# Altium schematic sheet 07.USB_DP Configure Map.SchDoc
size 840 x 594 mm; Revision: V2.1; Schematic Page Number: 11; Page Number: 8; Check: <Checker>; Schematic Name: RK_NVR_DEMO1_RK3588_LP4/4x_V21; Page Count: 43; Page name: 07.USB/DP Configure Map; Designer: Zhangdz; Schematic Page Count: 99; Revcode: V2.1; DsnPath: E:\Work\SBER\RK3588_SOM\temp\RK_NVR_DEMO1_RK3588_LP4XD200P232SD8_V21_20211228.DSN; SchematicName: RK_NVR_DEMO1_RK3588_LP4/4x_V21; PageName: 07.USB/DP Configure Map; PageSize: A1; TopSchematic: True
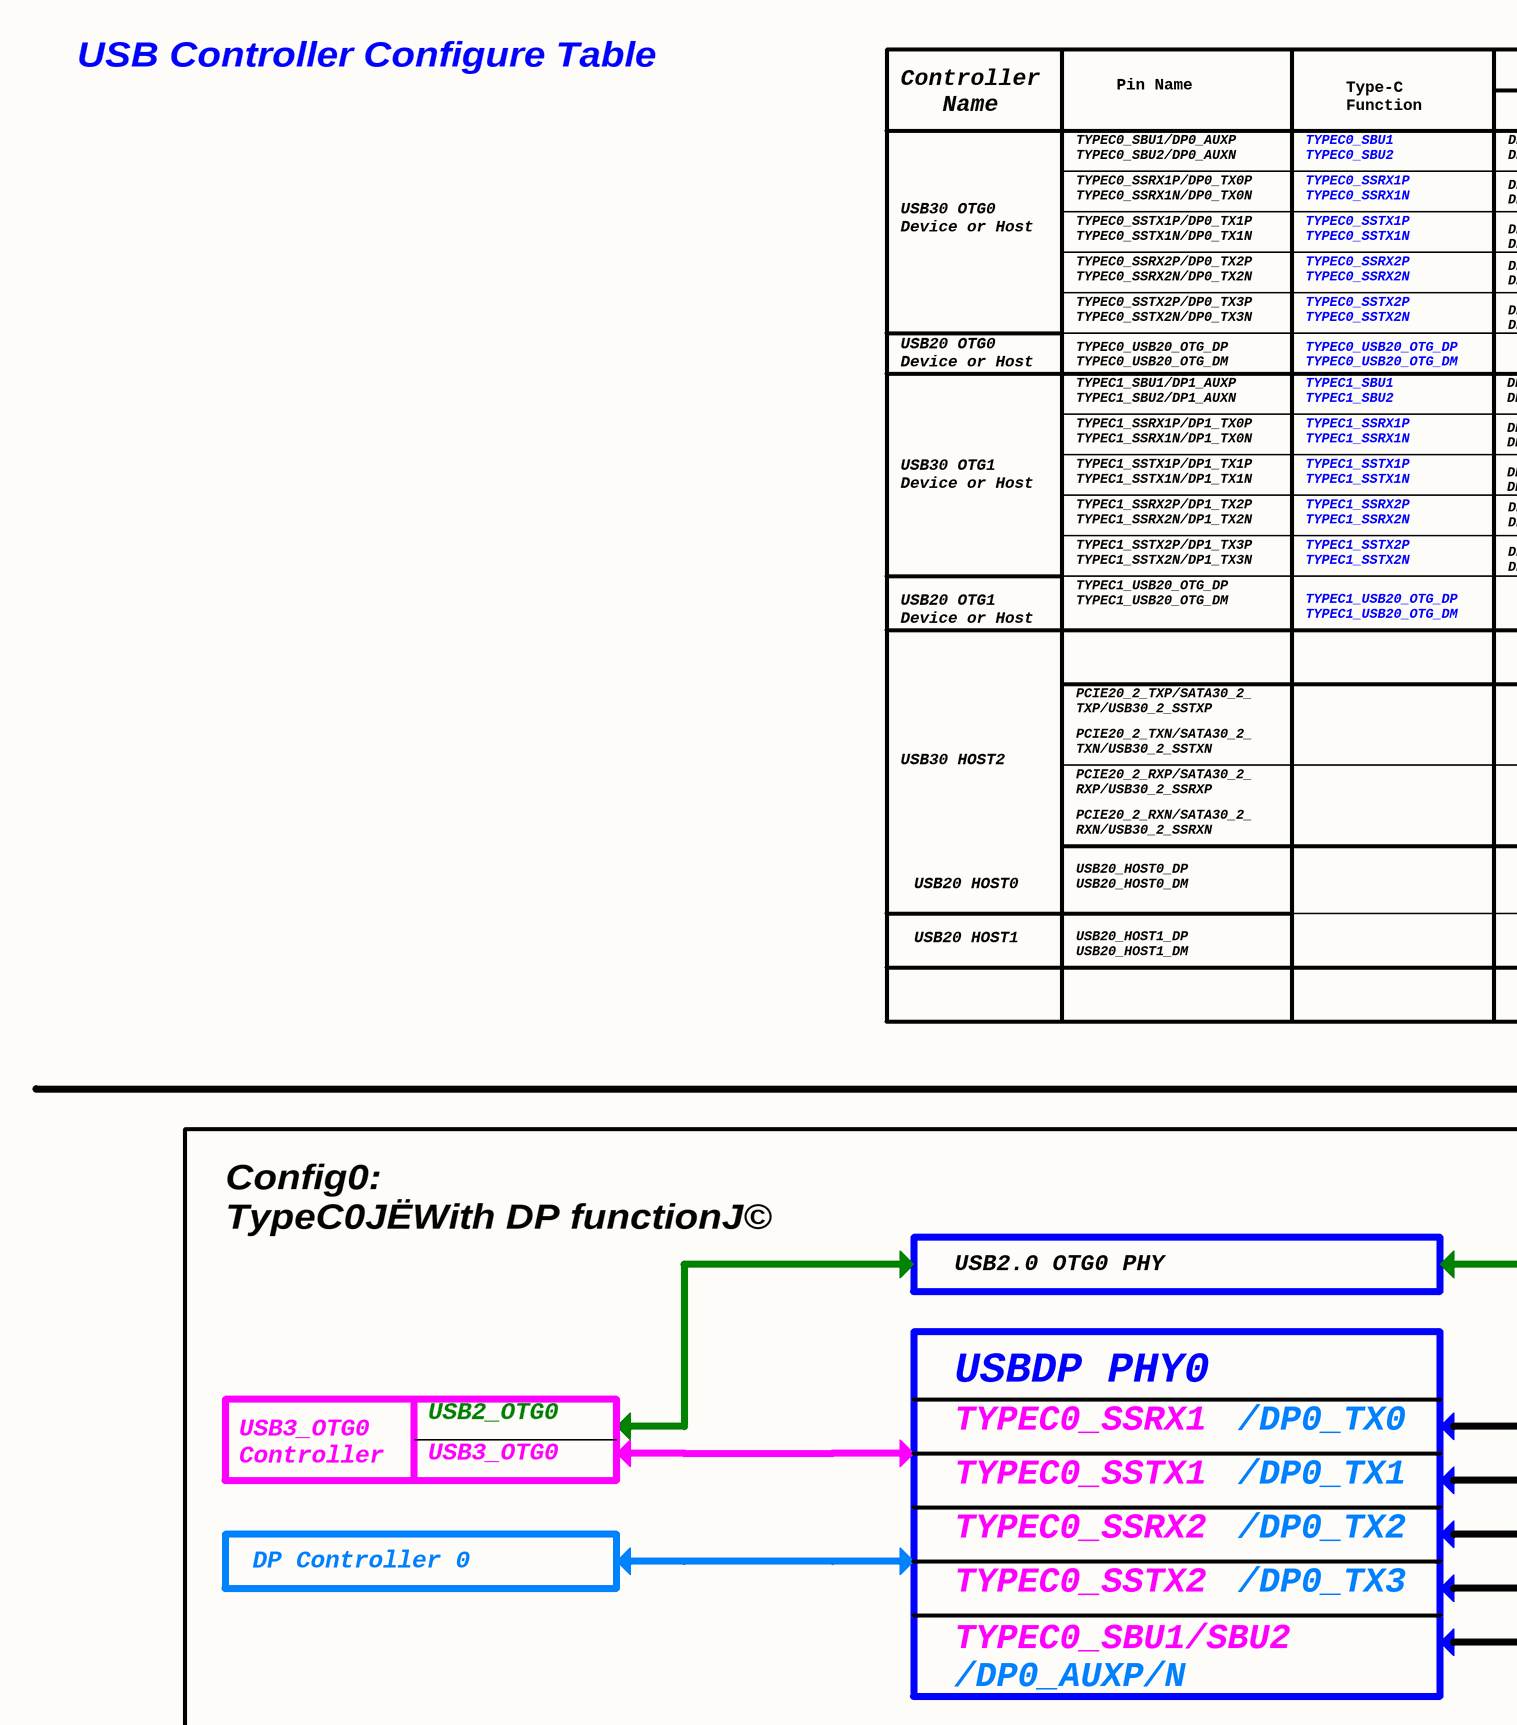
[diagram p0: 07.USB_DP Configure Map.SchDoc, top left]
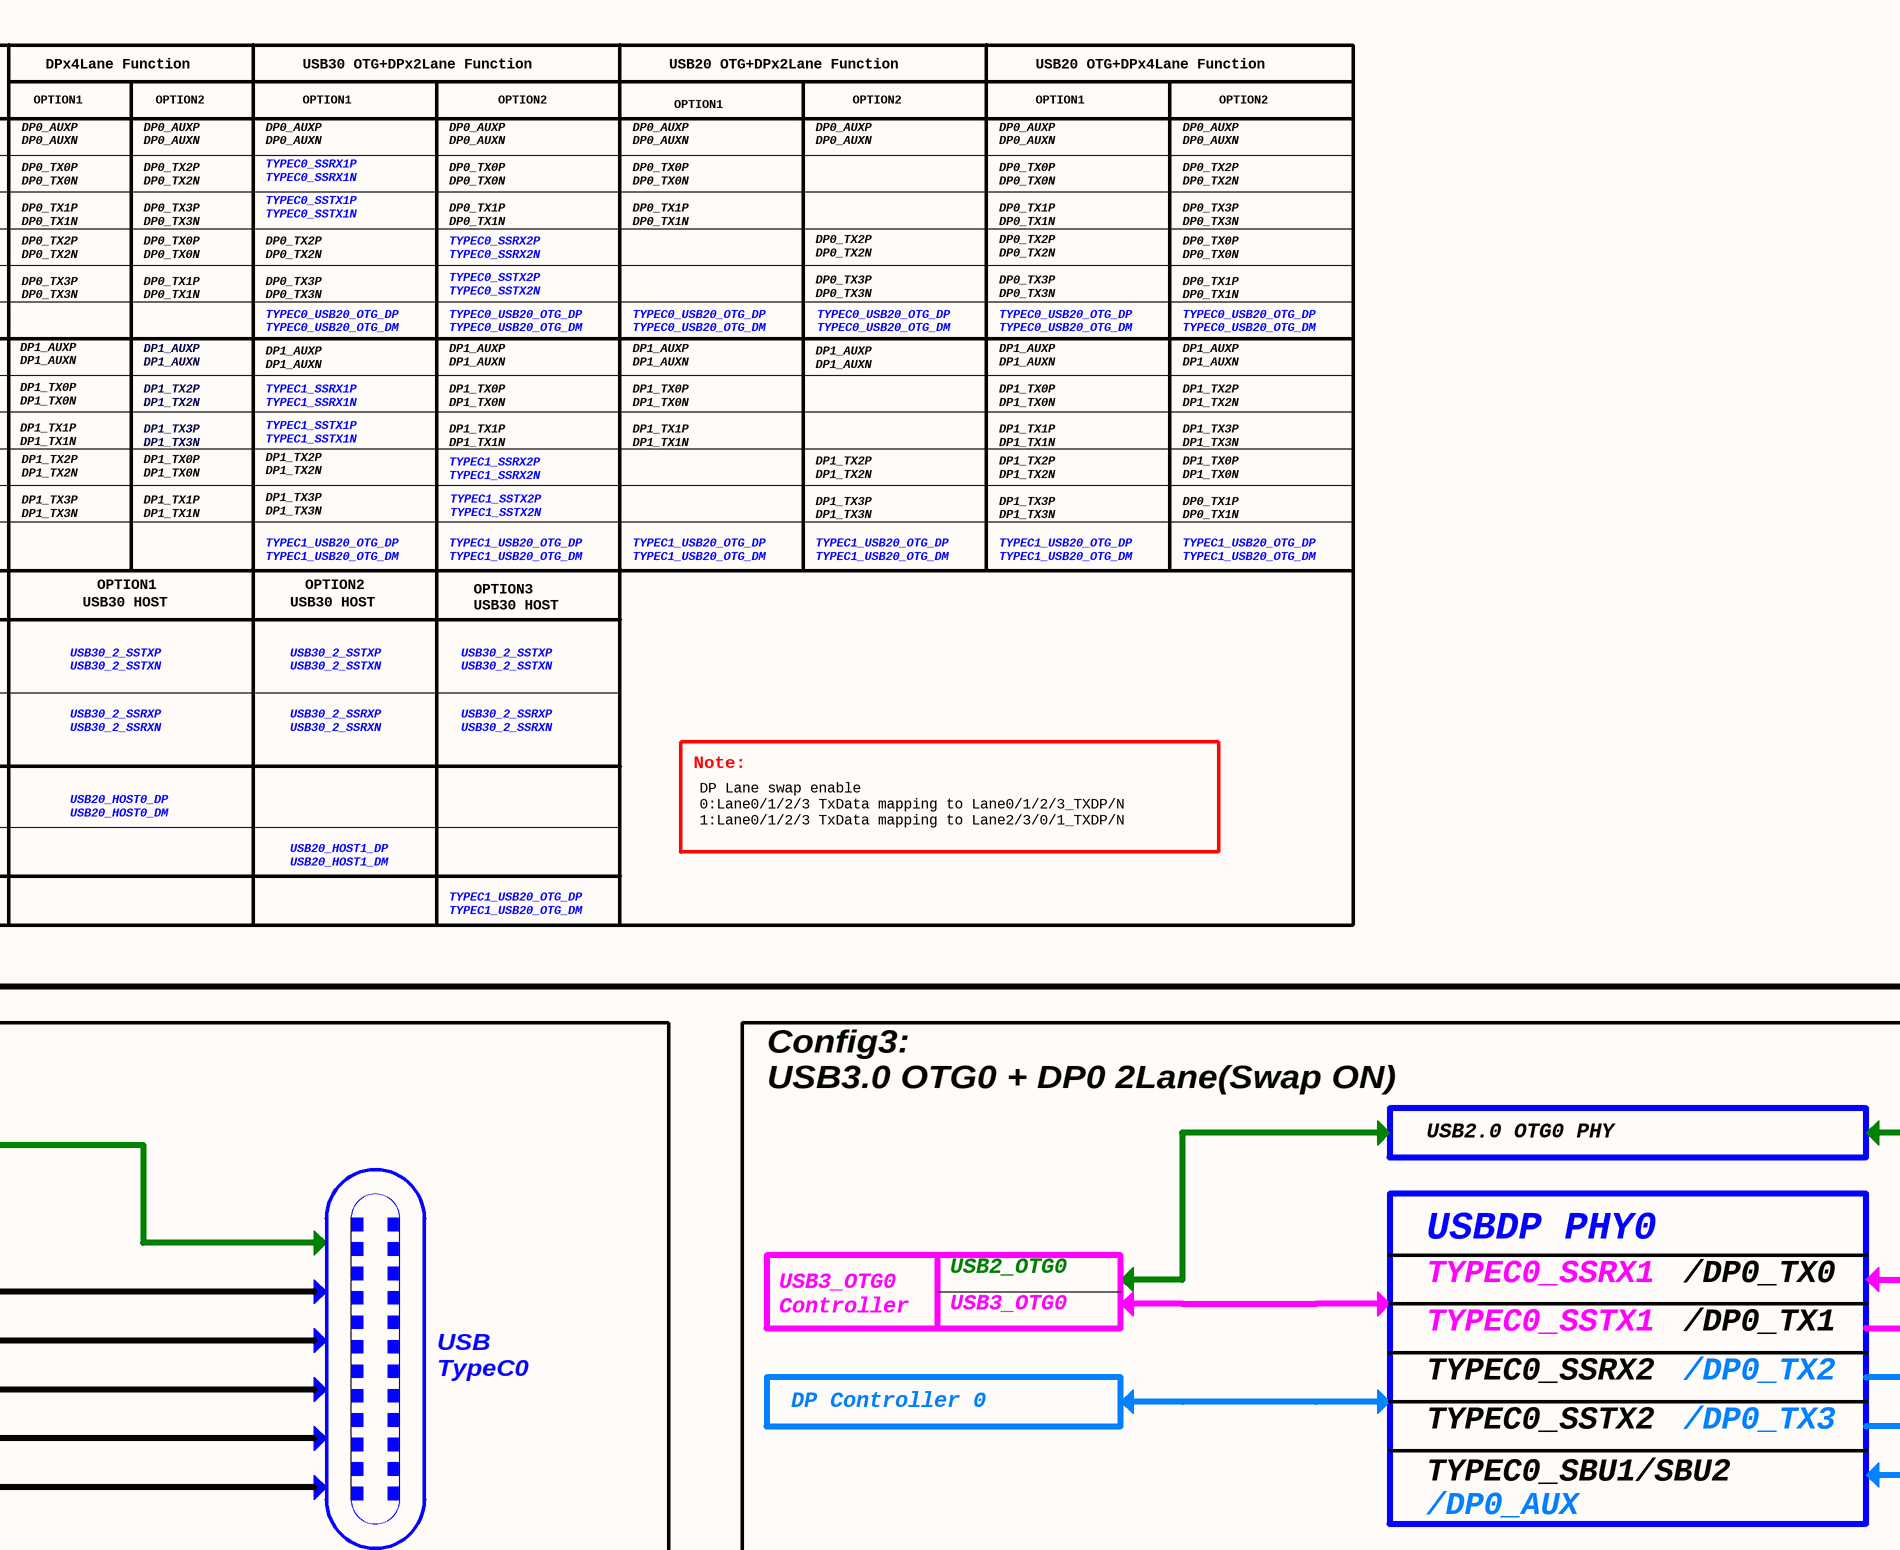
[diagram p1: 07.USB_DP Configure Map.SchDoc, top middle]
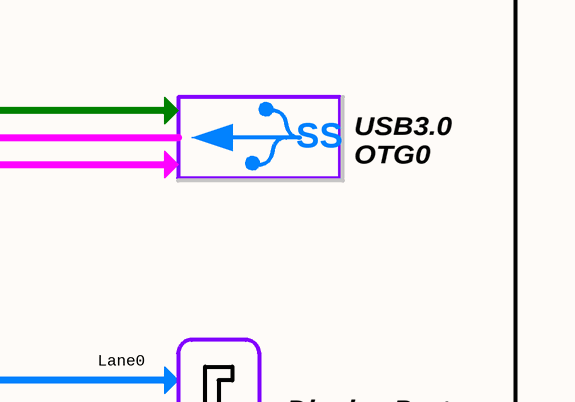
[diagram p2: 07.USB_DP Configure Map.SchDoc, top right]
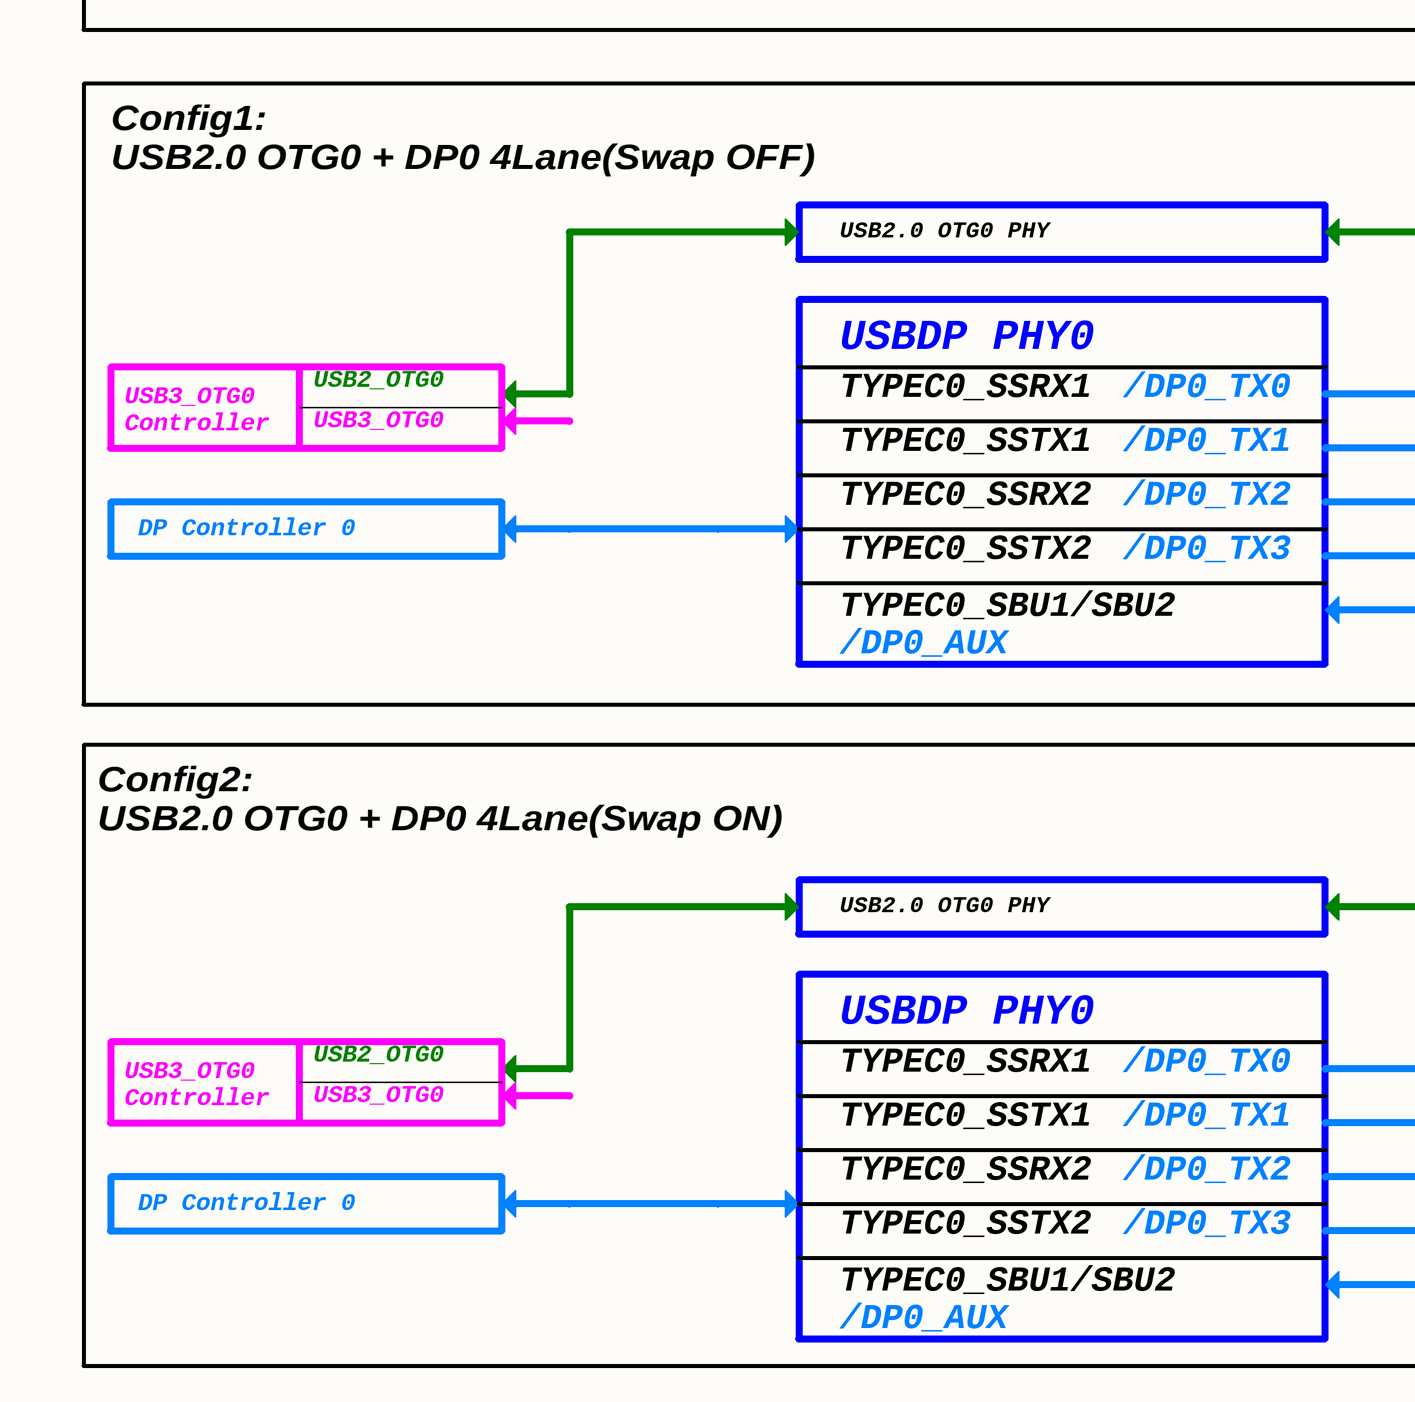
[diagram p3: 07.USB_DP Configure Map.SchDoc, bottom left]
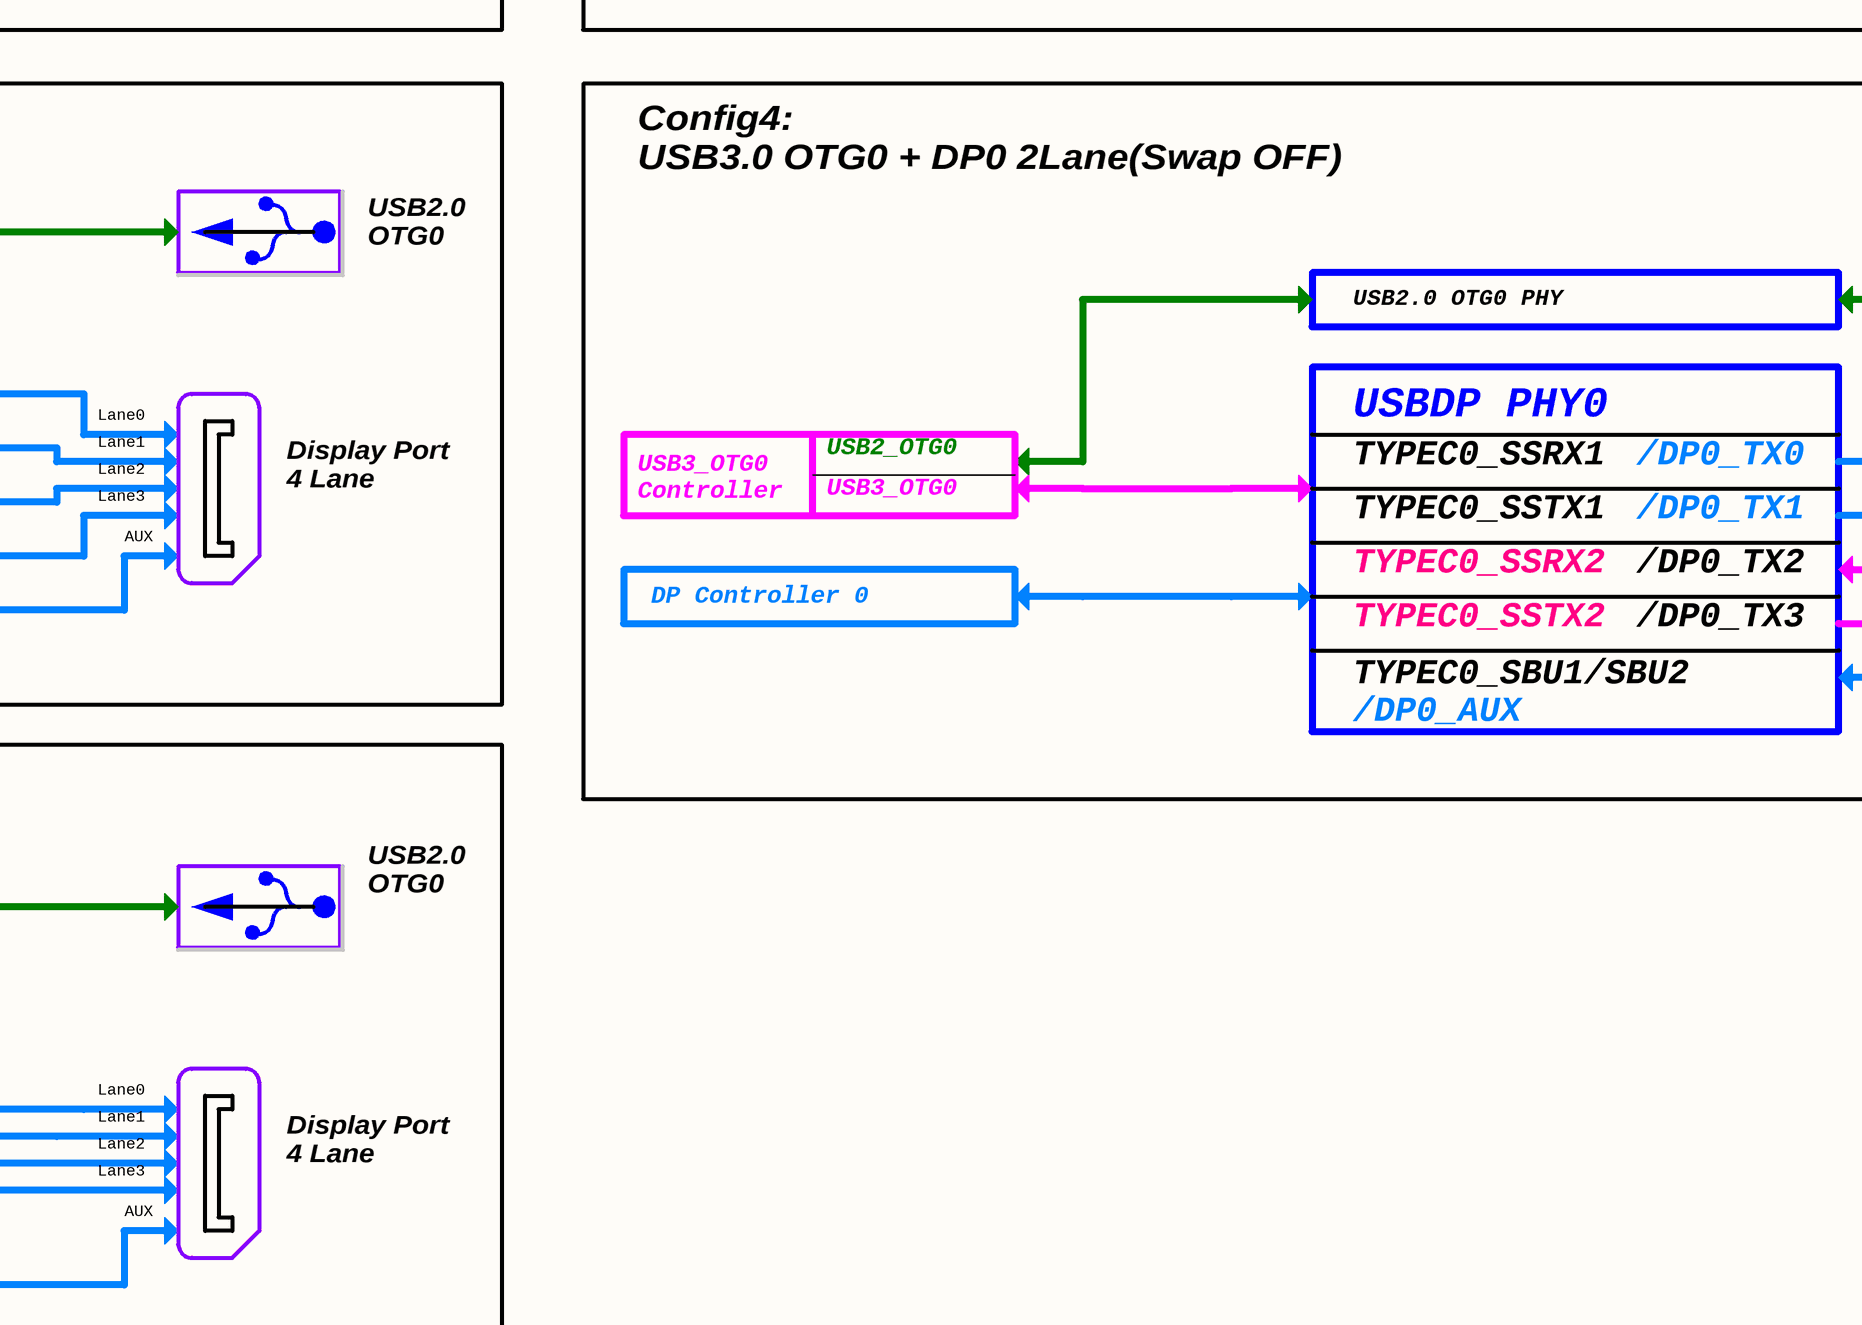
[diagram p4: 07.USB_DP Configure Map.SchDoc, bottom middle]
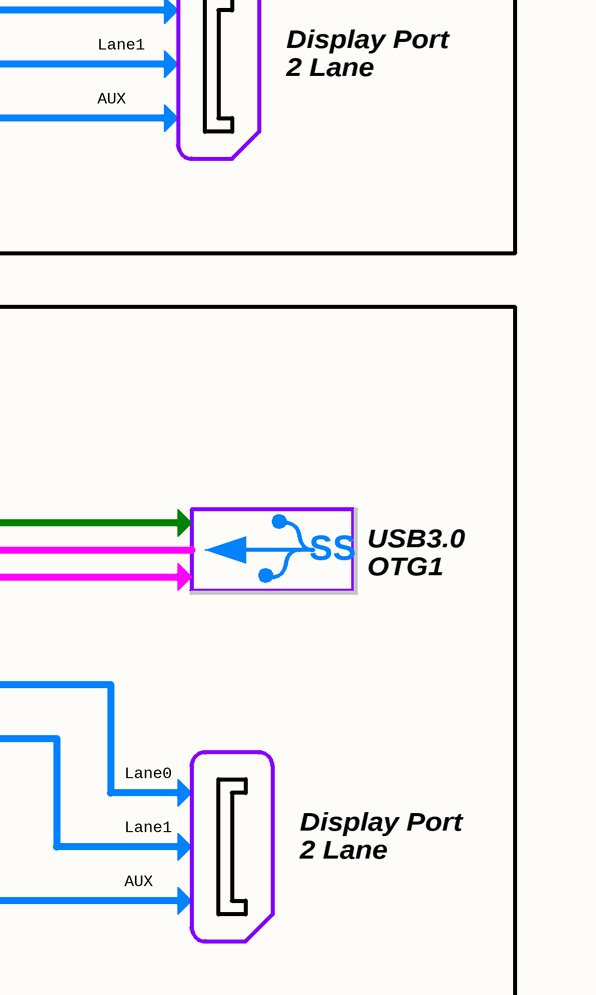
[diagram p5: 07.USB_DP Configure Map.SchDoc, bottom right]

## Notes on the sheet
- USB Controller Configure Table
- Controller
  Name
- Pin Name
- Type-C
  Function
- OPTION1
- DPx4Lane Function
- OPTION2
- USB30 OTG+DPx2Lane Function
- USB20 OTG+DPx2Lane Function
- USB20 OTG+DPx4Lane Function
- TYPEC0_SBU1/DP0_AUXP
  TYPEC0_SBU2/DP0_AUXN
- TYPEC0_SSRX1P/DP0_TX0P
  TYPEC0_SSRX1N/DP0_TX0N
- TYPEC0_SBU1
  TYPEC0_SBU2
- TYPEC0_SSRX1P
  TYPEC0_SSRX1N
- DP0_AUXP
  DP0_AUXN
- USB30 OTG0
  Device or Host
- TYPEC0_SSTX1P/DP0_TX1P
  TYPEC0_SSTX1N/DP0_TX1N
- TYPEC0_SSTX1P
  TYPEC0_SSTX1N
- DP0_AUXP
  DP0_AUXN
  DP0_TX0P
  DP0_TX0N
  DP0_TX1P
  DP0_TX1N
- DP0_AUXP
  DP0_AUXN
  DP0_TX2P
  DP0_TX2N
  DP0_TX3P
  DP0_TX3N
- TYPEC0_SSRX2P/DP0_TX2P
  TYPEC0_SSRX2N/DP0_TX2N
- TYPEC0_SSTX2P/DP0_TX3P
  TYPEC0_SSTX2N/DP0_TX3N
- TYPEC0_SSRX2P
  TYPEC0_SSRX2N
- TYPEC0_SSTX2P
  TYPEC0_SSTX2N
- DP0_TX2P
  DP0_TX2N
  DP0_TX3P
  DP0_TX3N
- DP0_TX0P
  DP0_TX0N
  DP0_TX1P
  DP0_TX1N
- USB20 OTG0
  Device or Host
- TYPEC1_SBU1/DP1_AUXP
  TYPEC1_SBU2/DP1_AUXN
- TYPEC0_USB20_OTG_DP
  TYPEC0_USB20_OTG_DM
- TYPEC1_SBU1
  TYPEC1_SBU2
- TYPEC1_SSRX1P/DP1_TX0P
  TYPEC1_SSRX1N/DP1_TX0N
- TYPEC1_SSRX1P
  TYPEC1_SSRX1N
- DP1_AUXP
  DP1_AUXN
- USB30 OTG1
  Device or Host
- TYPEC1_SSTX1P/DP1_TX1P
  TYPEC1_SSTX1N/DP1_TX1N
- TYPEC1_SSRX2P/DP1_TX2P
  TYPEC1_SSRX2N/DP1_TX2N
- TYPEC1_SSTX1P
  TYPEC1_SSTX1N
- TYPEC1_SSRX2P
  TYPEC1_SSRX2N
- DP1_AUXP
  DP1_AUXN
  DP1_TX0P
  DP1_TX0N
  DP1_TX1P
  DP1_TX1N
- DP1_AUXP
  DP1_AUXN
  DP1_TX2P
  DP1_TX2N
  DP1_TX3P
  DP1_TX3N
- TYPEC1_USB20_OTG_DP
  TYPEC1_USB20_OTG_DM
- TYPEC1_SSTX2P/DP1_TX3P
  TYPEC1_SSTX2N/DP1_TX3N
- TYPEC1_SSTX2P
  TYPEC1_SSTX2N
- DP1_TX2P
  DP1_TX2N
  DP1_TX3P
  DP1_TX3N
- DP1_TX0P
  DP1_TX0N
  DP1_TX1P
  DP1_TX1N
- DP1_TX0P
  DP1_TX0N
  DP0_TX1P
  DP0_TX1N
- USB20 OTG1
  Device or Host
- USB30 HOST
- OPTION3
  USB30 HOST
- PCIE20_2_TXP/SATA30_2_
  TXP/USB30_2_SSTXP
- USB30_2_SSTXP
  USB30_2_SSTXN
- USB30 HOST2
- PCIE20_2_TXN/SATA30_2_
  TXN/USB30_2_SSTXN
- PCIE20_2_RXP/SATA30_2_
  RXP/USB30_2_SSRXP
- USB30_2_SSRXP
  USB30_2_SSRXN
- PCIE20_2_RXN/SATA30_2_
  RXN/USB30_2_SSRXN
- Note:
- USB20 HOST0
- USB20 HOST1
- USB20_HOST0_DP
  USB20_HOST0_DM
- DP Lane swap enable
  0:Lane0/1/2/3 TxData mapping to Lane0/1/2/3_TXDP/N
  1:Lane0/1/2/3 TxData mapping to Lane2/3/0/1_TXDP/N
- USB20_HOST1_DP
  USB20_HOST1_DM
- Config3:
  USB3.0 OTG0 + DP0 2Lane(Swap ON)
- Config0:
  TypeC0ЈЁWith DP functionЈ©
- USB2.0 OTG0 PHY
- SS
- USB3.0
  OTG0
- USBDP PHY0
- USB2_OTG0
- USB3_OTG0
  Controller
- USB3_OTG0
- TYPEC0_SSRX1
- /DP0_TX0
- TYPEC0_SSTX1
- /DP0_TX1
- TYPEC0_SSRX2
- /DP0_TX2
- USB
  TypeC0
- Lane0
- DP Controller 0
- TYPEC0_SSTX2
- /DP0_TX3
- Lane1
- AUX
- Display Port
  2 Lane
- TYPEC0_SBU1/SBU2
- /DP0_AUX
- /DP0_AUXP/N
- Config1:
  USB2.0 OTG0 + DP0 4Lane(Swap OFF)
- Config4:
  USB3.0 OTG0 + DP0 2Lane(Swap OFF)
- USB2.0
  OTG0
- USB3.0
  OTG1
- Lane2
- Display Port
  4 Lane
- Lane3
- Config2:
  USB2.0 OTG0 + DP0 4Lane(Swap ON)